# Altium schematic sheet RC motor driver.SchDoc
size A4
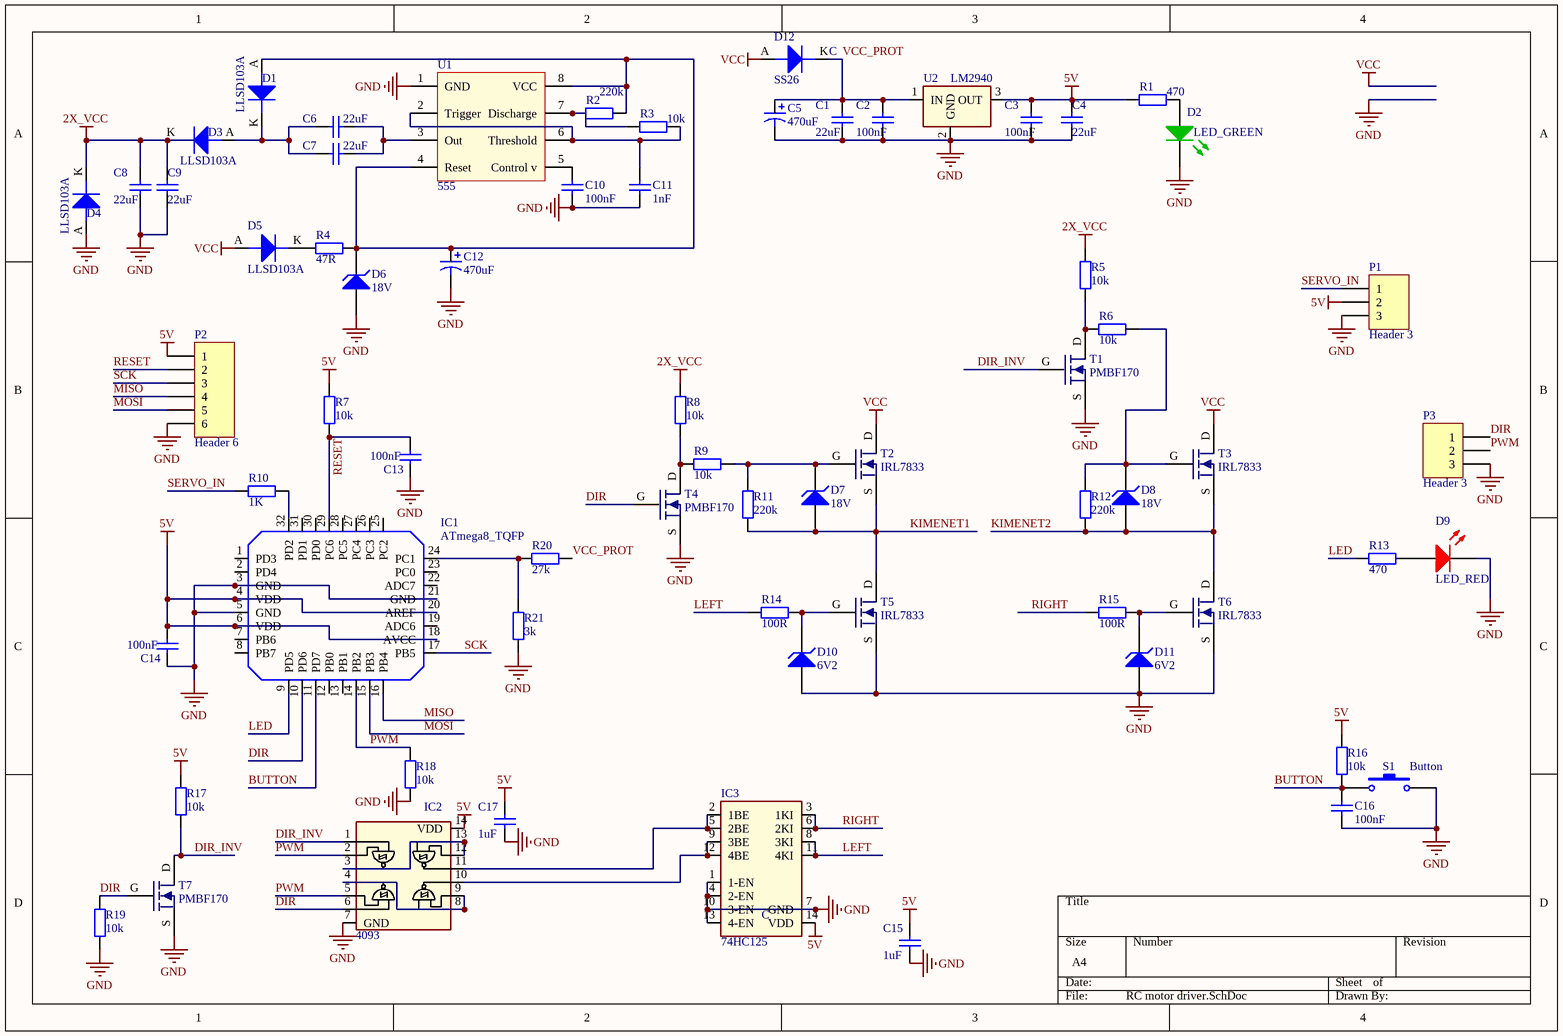
[diagram p0: RC motor driver.SchDoc]

## Parts
C1  22uF  [FP_1210_CAP_N]
C2  100nF  [FP_0805_CAP_085]
C3  100nF  [FP_0805_CAP_085]
C4  22uF  [FP_1210_CAP_N]
C5  470uF  [cap_10x12]
C6  22uF  [FP_1210_CAP_N]
C7  22uF  [FP_1210_CAP_N]
C8  22uF  [FP_1210_CAP_N]
C9  22uF  [FP_1210_CAP_N]
C10  100nF  [FP_0805_CAP_085]
C11  1nF  [FP_0805_CAP_085]
C12  470uF  [cap_10x12]
C13  100nF  [FP_0805_CAP_085]
C14  100nF  [FP_0805_CAP_085]
C15  1uF  [FP_0805_CAP_085]
C16  100nF  [FP_0805_CAP_085]
C17  1uF  [FP_0805_CAP_085]
D1  LLSD103A  [SOD-80]
D2  LED_GREEN  [FP_0805_LED_GREEN]
D3  LLSD103A  [SOD-80]
D4  LLSD103A  [SOD-80]
D5  LLSD103A  [SOD-80]
D6  18V  [SOD-80]
D7  18V  [SOD-80]
D8  18V  [SOD-80]
D9  LED_RED  [FP_0805_LED_RED]
D10  6V2  [SOD-80]
D11  6V2  [SOD-80]
D12  SS26  [subsma]
IC1  ATmega8_TQFP  [TQFP32_N]
IC2  4093  [Gate_SOIC14]
IC3  74HC125  [Gate_SOIC14]
P1  Header 3  [HDR1X3]
P2  Header 6  [HDR1X6]
P3  Header 3  [HDR1X3]
R1  470  [FP_0805_RES]
R2  220k  [FP_0805_RES]
R3  10k  [FP_0805_RES]
R4  47R  [FP_0805_RES]
R5  10k  [FP_0805_RES]
R6  10k  [FP_0805_RES]
R7  10k  [FP_0805_RES]
R8  10k  [FP_0805_RES]
R9  10k  [FP_0805_RES]
R10  1K  [FP_0805_RES]
R11  220k  [FP_0805_RES]
R12  220k  [FP_0805_RES]
R13  470  [FP_0805_RES]
R14  100R  [FP_0805_RES]
R15  100R  [FP_0805_RES]
R16  10k  [FP_0805_RES]
R17  10k  [FP_0805_RES]
R18  10k  [FP_0805_RES]
R19  10k  [FP_0805_RES]
R20  27k  [FP_0805_RES]
R21  3k  [FP_0805_RES]
S1  Button  [BUTTON_6X6 _SMD]
T1  PMBF170  [FET_SOT23]
T2  IRL7833  [FET_TO220-3 bent legs - inverse]
T3  IRL7833  [FET_TO220-3 bent legs - inverse]
T4  PMBF170  [FET_SOT23]
T5  IRL7833  [FET_TO220-3 bent legs - inverse]
T6  IRL7833  [FET_TO220-3 bent legs - inverse]
T7  PMBF170  [FET_SOT23]
U1  555  [DIGITAL_SOIC8]
U2  LM2940  [SUPPLY_TO220-3 bent legs - inverse]

## Nets
2X_VCC: C8.1 C9.1 D3.K D4.K R5.2 R8.2
5V: C3.1 C4.1 C14.2 C15.1 C17.1 IC1.4(VDD) IC1.6(VDD) IC1.18(AVCC) IC1.20(AREF) IC2.14(VDD) IC3.14(VDD) P1.2 P2.1 R1.1 R7.2 R16.2 R17.2 U2.3(OUT)
GND: C1.2 C2.2 C3.2 C4.2 C5.N C8.2 C9.2 C10.2 C11.2 C12.N C13.1 C14.1 C15.2 C16.1 C17.2 D2.K D4.A D6.A D9.K D10.A D11.A IC1.3(GND) IC1.5(GND) IC1.21(GND) IC2.7(GND) IC3.1(1-EN) IC3.4(2-EN) IC3.7(GND) IC3.10(3-EN) IC3.13(4-EN) P1.3 P2.6 P3.3 R18.1 R19.1 R21.1 S1.2 T1.S T4.S T5.S T6.S T7.S U1.1(GND) U2.2(GND)
VCC: D5.A D12.A T2.D T3.D
BUTTON: C16.2 IC1.11(PD7) R16.1 S1.1
DIR: IC1.10(PD6) IC2.6 P3.1 R19.2 T4.G T7.G
DIR_INV: IC2.1 R17.1 T1.G T7.D
KIMENET1: D7.A R11.1 T2.S T5.D
KIMENET2: D8.A R12.1 T3.S T6.D
LED: IC1.9(PD5) R13.1
LEFT: IC3.8(3KI) IC3.11(4KI) R14.1
MISO: IC1.16(PB4) P2.4
MOSI: IC1.15(PB3) P2.5
PWM: IC1.14(PB2) IC2.2 IC2.5 P3.2 R18.2
RESET: C13.2 IC1.29(PC6) P2.2 R7.1
RIGHT: IC3.3(1KI) IC3.6(2KI) R15.1
SCK: IC1.17(PB5) P2.3
SERVO_IN: P1.1 R10.2
VCC_PROT: C1.1 C2.1 C5.P D12.K R20.1 U2.1(IN)
NetC6_1: C6.1 C7.1 U1.3(Out)
NetC6_2: C6.2 C7.2 D1.K D3.A
NetC10_1: C10.1 U1.5(Control_v)
NetC11_1: C11.1 R3.2 U1.2(Trigger) U1.6(Threshold)
NetC12_P: C12.P D1.A D6.K R2.2 R4.2 U1.4(Reset) U1.8(VCC)
NetD2_A: D2.A R1.2
NetD5_K: D5.K R4.1
NetD7_K: D7.K R9.2 R11.2 T2.G
NetD8_K: D8.K R6.2 R12.2 T3.G
NetD9_A: D9.A R13.2
NetD10_K: D10.K R14.2 T5.G
NetD11_K: D11.K R15.2 T6.G
NetIC1_24: IC1.24(PC1) R20.2 R21.2
NetIC1_32: IC1.32(PD2) R10.1
NetIC2_3: IC2.3 IC2.12 IC2.13
NetIC2_4: IC2.4 IC2.8 IC2.9
NetIC2_10: IC2.10 IC3.9(3BE) IC3.12(4BE)
NetIC2_11: IC2.11 IC3.2(1BE) IC3.5(2BE)
NetR2_1: R2.1 R3.1 U1.7(Discharge)
NetR5_1: R5.1 R6.1 T1.D
NetR8_1: R8.1 R9.1 T4.D

Not connected (* = marked no-connect by the designer): IC1 1(PD3) 2(PD4) 7(PB6) 8(PB7) 12(PB0) 13(PB1) 19(ADC6) 22(ADC7) 23(PC0) 25(PC2) 26(PC3) 27(PC4) 28(PC5) 30(PD0) 31(PD1)

## Notes on the sheet
- (near D12) C
- (near IC3) C

## Library data of the parts
C1-C4 C6-C9 C15 C17 = CAP: Capacitor; Tűrés: 20% X7R; Order info: http://www.tme.eu/hu/details/cl32a226kojnnne/mlcc-smd-1210-kondenzatorok/samsung/
  C1 C4 C6-C9: Value: 22uF
  C2 C3: Value: 100nF
  C15 C17: Value: 1uF
C5 C12 = CAP_ELECT: Polarized Capacitor; Value: 470uF
C10 C11 C13 C14 C16 = CAP: Capacitor
  C10 C13 C14 C16: Value: 100nF
  C11: Value: 1nF
D1 D3-D5 D12 = DIODE_big
D2 = LED_G: Typical LED
D6-D8 D10 D11 = ZENER: Zener Diode; U_Z: 24
D9 = LED_R: Typical LED
IC2 = 4093: Quad 2-Input NAND Schmitt Trigger
P1 P3 = Header 3: Header, 3-Pin; LatestRevisionDate: 17-Jul-2002; LatestRevisionNote: Re-released for DXP Platform.; Publisher: Altium Limited
P2 = Header 6: Header, 6-Pin; LatestRevisionDate: 17-Jul-2002; LatestRevisionNote: Re-released for DXP Platform.; Publisher: Altium Limited
R1-R21 = RES: Resistor
  R1 R13: Value: 470
  R2 R11 R12: Value: 220k
  R3 R5-R9 R16-R19: Value: 10k
  R4: Value: 47R
  R10: Value: 1K
  R14 R15: Value: 100R
  R20: Value: 27k
  R21: Value: 3k
S1 = SW-PB: Switch; Published: 24-Mar-1999; LatestRevisionDate: 17-Jul-2002; LatestRevisionNote: Re-released for DXP Platform.; PackageReference: SPST-2; Publisher: Altium Limited; Order info: http://www.tme.eu/hu/details/tactm-67n-f/tact-pcb-mikrokapcsolok/ninigi/#
T1-T7 = NMOS
U1 = 555: 555 Counter
U2 = 78xx